# Altium schematic sheet 4 RF Attenuation Amp.SchDoc: RF Attenuation Amp
size A3; PageSetup: Record=PageOptions|CenterHorizontal=True|CenterVertical=True|PrintScale=1.01|XCorrection=1.00|YCorrection=1.00|PrintKind=2|BorderSize=5000000|LeftOffset=0|BottomOffset=0|Orientation=2|PaperLength=1000|PaperWidth=1000|Scale=100|PaperSource=15|PrintQuality=600|MediaType=1|DitherType=10|PaperKind=A3|PrintScaleMode=1; DocumentNumber: 4; SheetNumber: 5; SheetTotal: 7
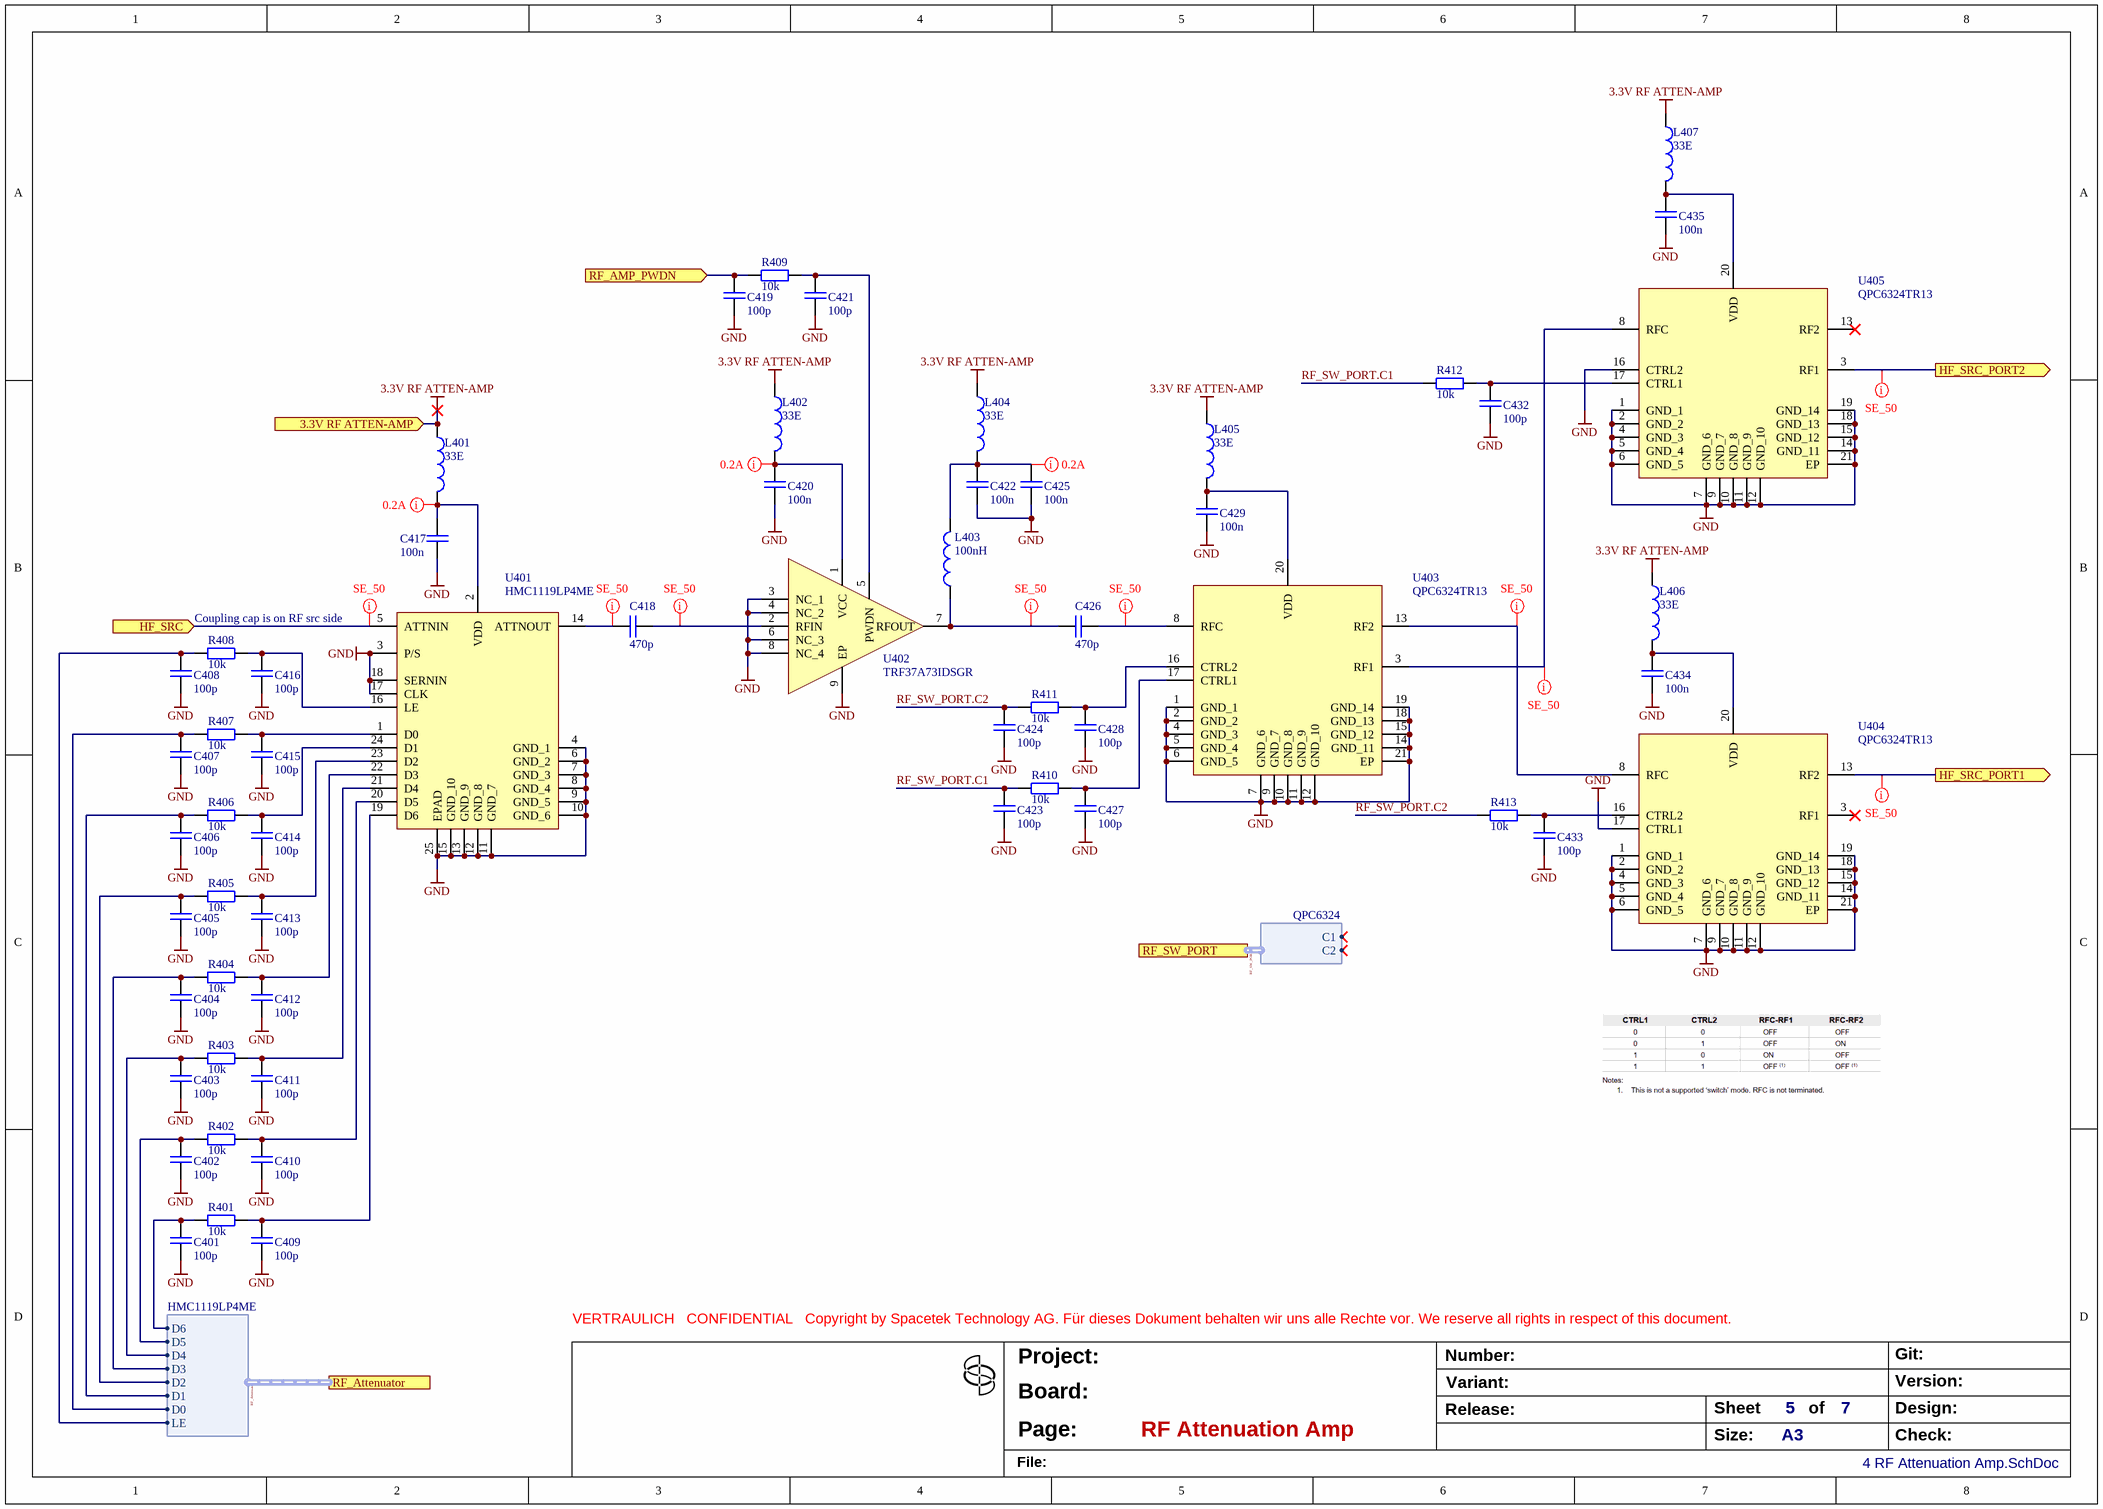
[diagram p0: 4 RF Attenuation Amp.SchDoc]

## Parts
C401  100p  [STT--CC--0402]
C402  100p  [STT--CC--0402]
C403  100p  [STT--CC--0402]
C404  100p  [STT--CC--0402]
C405  100p  [STT--CC--0402]
C406  100p  [STT--CC--0402]
C407  100p  [STT--CC--0402]
C408  100p  [STT--CC--0402]
C409  100p  [STT--CC--0402]
C410  100p  [STT--CC--0402]
C411  100p  [STT--CC--0402]
C412  100p  [STT--CC--0402]
C413  100p  [STT--CC--0402]
C414  100p  [STT--CC--0402]
C415  100p  [STT--CC--0402]
C416  100p  [STT--CC--0402]
C417  100n  [STT--CC--0402]
C418  470p  [STT--CC--0402]
C419  100p  [STT--CC--0402]
C420  100n  [STT--CC--0402]
C421  100p  [STT--CC--0402]
C422  100n  [STT--CC--0402]
C423  100p  [STT--CC--0402]
C424  100p  [STT--CC--0402]
C425  100n  [STT--CC--0402]
C426  470p  [STT--CC--0402]
C427  100p  [STT--CC--0402]
C428  100p  [STT--CC--0402]
C429  100n  [STT--CC--0402]
C432  100p  [STT--CC--0402]
C433  100p  [STT--CC--0402]
C434  100n  [STT--CC--0402]
C435  100n  [STT--CC--0402]
L401  33E  [STT--FB--0402]
L402  33E  [STT--FB--0402]
L403  100nH  [STT--RC--0603]
L404  33E  [STT--FB--0402]
L405  33E  [STT--FB--0402]
L406  33E  [STT--FB--0402]
L407  33E  [STT--FB--0402]
R401  10k  [STT--RC--0402]
R402  10k  [STT--RC--0402]
R403  10k  [STT--RC--0402]
R404  10k  [STT--RC--0402]
R405  10k  [STT--RC--0402]
R406  10k  [STT--RC--0402]
R407  10k  [STT--RC--0402]
R408  10k  [STT--RC--0402]
R409  10k  [STT--RC--0402]
R410  10k  [STT--RC--0402]
R411  10k  [STT--RC--0402]
R412  10k  [STT--RC--0402]
R413  10k  [STT--RC--0402]
U401  HMC1119LP4ME  [ADI--IC--LFCSP-24]
U402  TRF37A73IDSGR  [TI--IC--WSON-8]
U403  QPC6324TR13  [QV--IC--QFN-20]
U404  QPC6324TR13  [QV--IC--QFN-20]
U405  QPC6324TR13  [QV--IC--QFN-20]

## Ports
3.3V RF ATTEN-AMP (in), HF_SRC (in), HF_SRC_PORT1 (out), HF_SRC_PORT2 (out), RF_AMP_PWDN (in), RF_Attenuator (harness HMC1119LP4ME), RF_SW_PORT (harness QPC6324)

## Harnesses
HMC1119LP4ME: D6, D5, D4, D3, D2, D1, LE, D0
QPC6324: C1, C2

## Nets
3.3V RF ATTEN-AMP: L401.1 L402.1 L404.1 L405.1 L406.1 L407.1 ; port 3.3V RF ATTEN-AMP
GND: C401.1 C402.1 C403.1 C404.1 C405.1 C406.1 C407.1 C408.1 C409.1 C410.1 C411.1 C412.1 C413.1 C414.1 C415.1 C416.1 C417.2 C419.1 C420.1 C421.1 C422.1 C423.1 C424.1 C425.1 C427.1 C428.1 C429.1 C432.1 C433.1 C434.1 C435.1 U401.3(P/S) U401.4(GND_1) U401.6(GND_2) U401.7(GND_3) U401.8(GND_4) U401.9(GND_5) U401.10(GND_6) U401.11(GND_7) U401.12(GND_8) U401.13(GND_9) U401.15(GND_10) U401.17(CLK) U401.18(SERNIN) U401.25(EPAD) U402.3(NC_1) U402.4(NC_2) U402.6(NC_3) U402.8(NC_4) U402.9(EP) U403.1(GND_1) U403.2(GND_2) U403.4(GND_3) U403.5(GND_4) U403.6(GND_5) U403.7(GND_6) U403.9(GND_7) U403.10(GND_8) U403.11(GND_9) U403.12(GND_10) U403.14(GND_11) U403.15(GND_12) U403.18(GND_13) U403.19(GND_14) U403.21(EP) U404.1(GND_1) U404.2(GND_2) U404.4(GND_3) U404.5(GND_4) U404.6(GND_5) U404.7(GND_6) U404.9(GND_7) U404.10(GND_8) U404.11(GND_9) U404.12(GND_10) U404.14(GND_11) U404.15(GND_12) U404.17(CTRL1) U404.18(GND_13) U404.19(GND_14) U404.21(EP) U405.1(GND_1) U405.2(GND_2) U405.4(GND_3) U405.5(GND_4) U405.6(GND_5) U405.7(GND_6) U405.9(GND_7) U405.10(GND_8) U405.11(GND_9) U405.12(GND_10) U405.14(GND_11) U405.15(GND_12) U405.16(CTRL2) U405.18(GND_13) U405.19(GND_14) U405.21(EP)
HF_SRC: U401.5(ATTNIN) ; port HF_SRC
HF_SRC_PORT1: U404.13(RF2) ; port HF_SRC_PORT1
HF_SRC_PORT2: U405.3(RF1) ; port HF_SRC_PORT2
RF_AMP_PWDN: C419.2 R409.1 ; port RF_AMP_PWDN
RF_Attenuator.D0: C407.2 R407.2 ; port RF_Attenuator.D0
RF_Attenuator.D1: C406.2 R406.2 ; port RF_Attenuator.D1
RF_Attenuator.D2: C405.2 R405.2 ; port RF_Attenuator.D2
RF_Attenuator.D3: C404.2 R404.2 ; port RF_Attenuator.D3
RF_Attenuator.D4: C403.2 R403.2 ; port RF_Attenuator.D4
RF_Attenuator.D5: C402.2 R402.2 ; port RF_Attenuator.D5
RF_Attenuator.D6: C401.2 R401.2 ; port RF_Attenuator.D6
RF_Attenuator.LE: C408.2 R408.2 ; port RF_Attenuator.LE
RF_SW_PORT.C1: C423.2 R410.2 R412.2
RF_SW_PORT.C2: C424.2 R411.2 R413.2
NetC409_2: C409.2 R401.1 U401.19(D6)
NetC410_2: C410.2 R402.1 U401.20(D5)
NetC411_2: C411.2 R403.1 U401.21(D4)
NetC412_2: C412.2 R404.1 U401.22(D3)
NetC413_2: C413.2 R405.1 U401.23(D2)
NetC414_2: C414.2 R406.1 U401.24(D1)
NetC415_2: C415.2 R407.1 U401.1(D0)
NetC416_2: C416.2 R408.1 U401.16(LE)
NetC417_1: C417.1 L401.2 U401.2(VDD)
NetC418_1: C418.1 U401.14(ATTNOUT)
NetC418_2: C418.2 U402.2(RFIN)
NetC420_2: C420.2 L402.2 U402.1(VCC)
NetC421_2: C421.2 R409.2 U402.5(PWDN)
NetC422_2: C422.2 C425.2 L403.2 L404.2
NetC426_1: C426.1 L403.1 U402.7(RFOUT)
NetC426_2: C426.2 U403.8(RFC)
NetC427_2: C427.2 R410.1 U403.17(CTRL1)
NetC428_2: C428.2 R411.1 U403.16(CTRL2)
NetC429_2: C429.2 L405.2 U403.20(VDD)
NetC432_2: C432.2 R412.1 U405.17(CTRL1)
NetC433_2: C433.2 R413.1 U404.16(CTRL2)
NetC434_2: C434.2 L406.2 U404.20(VDD)
NetC435_2: C435.2 L407.2 U405.20(VDD)
NetU403_3: U403.3(RF1) U405.8(RFC)
NetU403_13: U403.13(RF2) U404.8(RFC)

Not connected (* = marked no-connect by the designer): U404 3(RF1)*; U405 13(RF2)*

## Buses and harness runs
harness RF_Attenuator = port RF_Attenuator
harness RF_SW_PORT = port RF_SW_PORT

## Layout directives
net class SE_50: HF_SRC, HF_SRC_PORT1, HF_SRC_PORT2, NetC418_1, NetC418_2, NetC426_1, NetC426_2, NetU403_3, NetU403_13
net class 0.2A: NetC417_1, NetC420_2, NetC422_2

## Notes on the sheet
- Coupling cap is on RF src side
- VERTRAULICH   CONFIDENTIAL   Copyright by Spacetek Technology AG. Für dieses Dokument behalten wir uns alle Rechte vor. We reserve all rights in respect of this document.
- Project:
- Number:
- Variant:
- Version:
- Git:
- Board:
- Page:
- Release:
- Size:
- Sheet
- A3
- of
- Design:
- Check:
- File:

## Library data of the parts
C401-C416 C419 C421 C423 C424 C427 C428 C432 C433 = CMP-010-000109-1: Capacitor ceramic 100p 50V 5% C0G AEC-Q200 SMD--0402; Partnumber: CL05C101JB51PND; Manufacturer: Samsung Electro-Mechanics; Component Category: Generic; Meta Data Version: v1.0; Package: SMD--0402; Status: released; Type: Capacitor ceramic; Value: 100p
C417 C420 C422 C425 C429 C434 C435 = 200032-3: Capacitor ceramic 100n 16V 10% X7R  SMD--0402; Partnumber: CL05B104KO5NNNC; Manufacturer: Samsung Electro-Mechanics; A-Number: 200032; Material: X7R; Voltage: 16V; Type: Capacitor ceramic; Tolerance: 10%; Status: released; Package: SMD--0402; Value: 100n
C418 C426 = CMP-010-000105-1: Capacitor ceramic 470p 50V 5% C0G  SMD--0402; Manufacturer: TDK; Partnumber: CGA2B2C0G1H471J050BA; Component Category: Generic; Meta Data Version: v1.0; Status: released; Value: 470p
L401 L402 L404-L407 = 300015-1: Ferrit Bead MPZ1005S330HT000 33E 3A 22mE SMD--0402; Manufacturer: TDK Group; preferred: Yes; A-Number: 300015; Status: active; Current: 3A; Type: Ferrit Bead; Value: 33E; Package: MPZ1005S330HT000; Special: 22mE; Partnumber: MPZ1005S330HT000
L403 = CMP-012-000031-2: Inductor 100nH 290mA AEC-Q200  SMD--0603; Manufacturer: Coilcraft; Partnumber: 0603DC-R10XJRW; Component Category: generic; Meta Data Version: v1.0; Type: Inductor; Status: released; Value: 100nH
R401-R413 = 100086-1: Resistor 10k 50V  0.063W 1%  SMD--0402; Partnumber: ERJ-2RKF1002X; Manufacturer: Panasonic; A-Number: 100086; Power: 0.063W; Status: released; Type: Resistor; Voltage: 50V; Tolerance: 1%; Value: 10k; Package: SMD--0402
U401 = CMP-153-000013-1: Attenuator HMC1119LP4ME, -2...-32dBm, 0.1-6Ghz; Manufacturer: Analog Devices; Component Category: Generic; Meta Data Version: v1.0; Status: released; Value: HMC1119LP4ME; Partnumber: HMC1119LP4ME; Type: Attenuator
U402 = CMP-153-000014-1: Amp TRF37A73IDSGR, +12dB, 0.1-6Ghz; Manufacturer: Texas Instruments; Component Category: Generic; Meta Data Version: v1.0; Type: Amp; Partnumber: TRF37A73IDSGR; Status: released; Value: TRF37A73IDSGR
U403-U405 = CMP-081-000012-1: RF Switch QPC6324TR13  5-6000MHz SPDT; Manufacturer: Qorvo; Component Category: Generic; Meta Data Version: v1.0; Value: QPC6324TR13; Partnumber: QPC6324TR13; Status: released; Type: RF-Switch